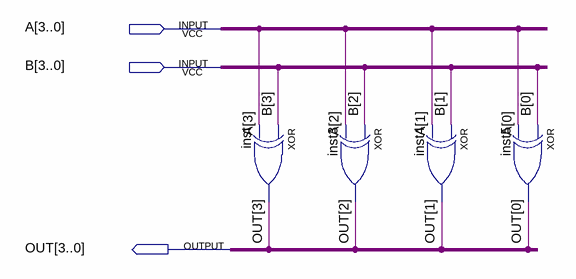
[diagram p0: schematic sheet]
// Quartus schematic AxorB.bdf as structural Verilog: 4 symbols, 3 pins
module AxorB (
  input  [3:0] A,
  input  [3:0] B,
  output [3:0] OUT
);

  xor inst (OUT[3], B[3], A[3]);
  xor inst3 (OUT[2], B[2], A[2]);
  xor inst4 (OUT[1], B[1], A[1]);
  xor inst5 (OUT[0], B[0], A[0]);
endmodule
